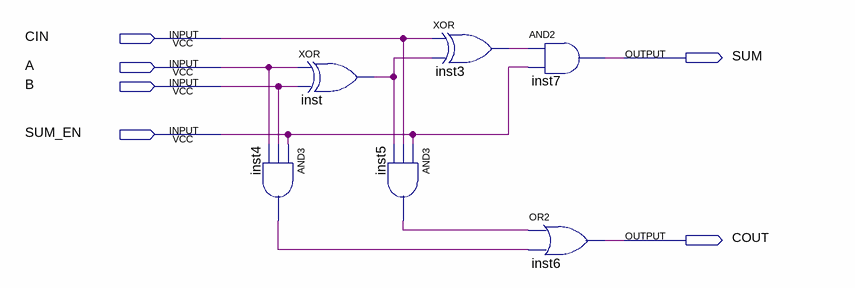
[diagram p0: schematic sheet]
// Quartus schematic FULLADDER_1bit.bdf as structural Verilog: 6 symbols, 6 pins
module FULLADDER_1bit (
  input  CIN,
  input  A,
  input  B,
  input  SUM_EN,
  output SUM,
  output COUT
);

  wire inst3_out, inst4_out, inst5_out, inst_out;

  and inst4 (inst4_out, SUM_EN, B, A);
  xor inst (inst_out, A, B);
  and inst5 (inst5_out, SUM_EN, CIN, inst_out);
  xor inst3 (inst3_out, CIN, inst_out);
  and inst7 (SUM, inst3_out, SUM_EN);
  or inst6 (COUT, inst5_out, inst4_out);
endmodule
